# EAGLE design EnvironmentMonitorV3 (EAGLE 7.4.0)
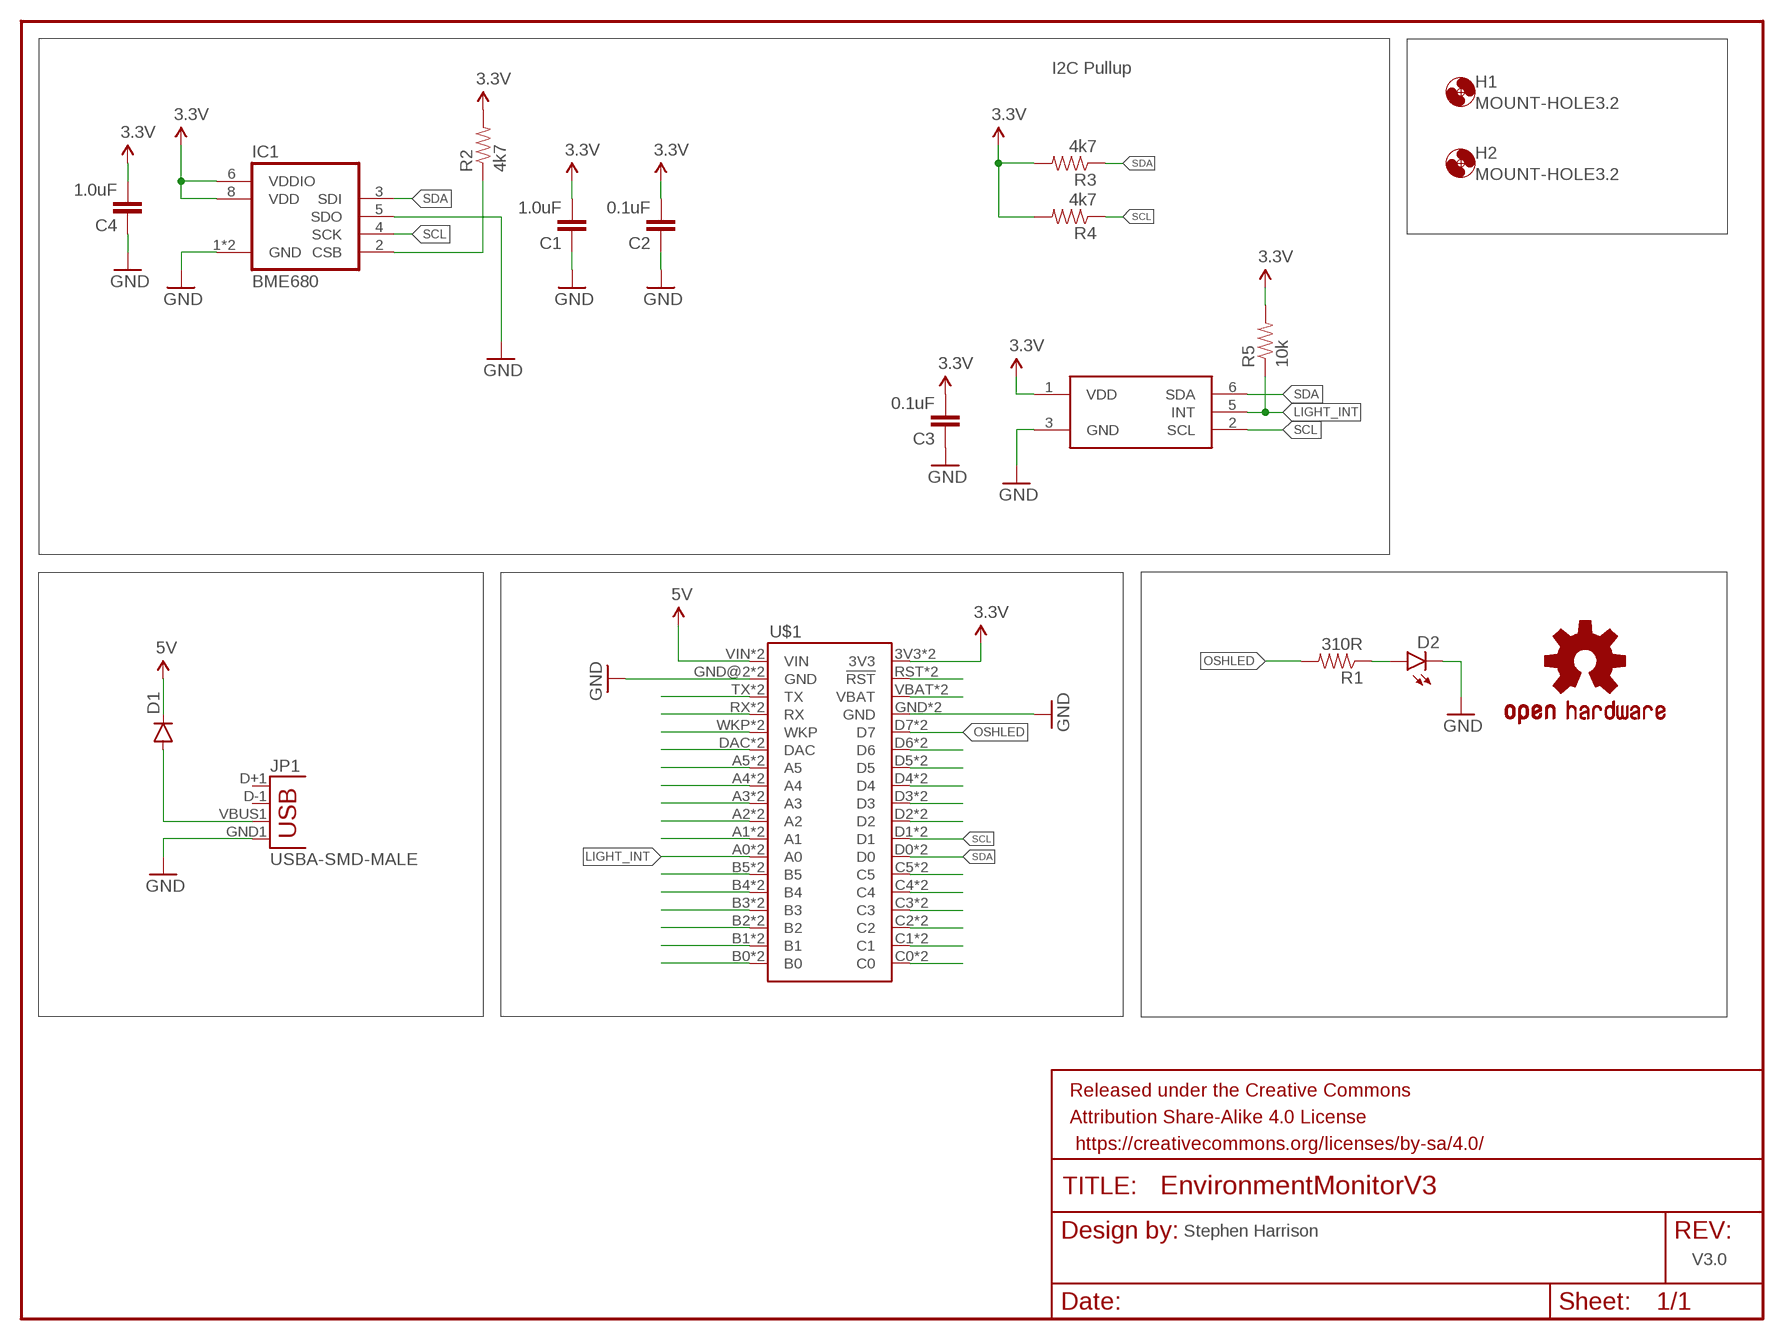
[diagram p0: schematic, sheet 1]

## Parts
C1  1.0uF  1.0UF-25V-+80/-20(0805)"  [0805-CAP]
C2  0.1uF  1.0UF-25V-+80/-20(0805)"  [0805-CAP]
C3  0.1uF  1.0UF-25V-+80/-20(0805)"  [0805-CAP]
C4  1.0uF  1.0UF-25V-+80/-20(0805)"  [0805-CAP]
D1  DIODESMA  [SMA-DIODE]
D2  LED1206-BOTTOM  [LED-1206-BOTTOM]
FRAME1  FRAME-LETTER  [CREATIVE_COMMONS]
H1  MOUNT-HOLE3.2  [3,2]
H2  MOUNT-HOLE3.2  [3,2]
IC1  BME680  [BME680]
JP1  USBA-SMD-MALE  [USB-A-SMT-MALE]
LOGO1  OSHW-LOGOM  [OSHW-LOGO-M]
R1  310R  RESISTOR0805-RES  [0805]
R2  4k7  RESISTOR0805-RES  [0805]
R3  4k7  RESISTOR0805-RES  [0805]
R4  4k7  RESISTOR0805-RES  [0805]
R5  10k  RESISTOR0805-RES  [0805]
U$1  ELECTRONDUALNAMED  [ELECTRON_SIMPLE_SILK_NAMES_DUAL]
U$2  TCS3472  [FN-6]

## Nets
3.3V: C1.2 C2.2 C3.2 C4.2 IC1.6(VDDIO) IC1.8(VDD) R2.2 R3.2 R4.2 R5.2 U$1.3V3 U$1.3V3_1(3V3) U$2.1(VDD)
5V: D1.C U$1.VIN U$1.VIN_1B(VIN)
GND: C1.1 C2.1 C3.1 C4.1 D2.C IC1.1(GND) IC1.5(SDO) IC1.7(GND) JP1.GND1(GND) U$1.GND U$1.GND@2(GND) U$1.GND_1(GND) U$1.GND_1B(GND) U$2.3(GND)
LIGHT_INT: R5.1 U$1.A0 U$1.A0_1(A0) U$2.5(INT)
N$1: U$1.RST(!RST) U$1.RST_1(!RST)
N$2: U$1.VBAT U$1.VBATT_1(VBAT)
N$3: IC1.2(CSB) R2.1
N$4: U$1.D6 U$1.D6_1(D6)
N$5: D1.A JP1.VBUS1(VBUS)
N$6: D2.A R1.1
N$7: U$1.D5 U$1.D5_1(D5)
N$8: U$1.D2 U$1.D2_1(D2)
N$9: U$1.D4 U$1.D4_1(D4)
N$10: U$1.D3 U$1.D3_1(D3)
N$11: U$1.C5 U$1.C5_1(C5)
N$12: U$1.C4 U$1.C4_1(C4)
N$13: U$1.C3 U$1.C3_1(C3)
N$14: U$1.C2 U$1.C2_1(C2)
N$15: U$1.C1 U$1.C1_1(C1)
N$16: U$1.C0 U$1.C0_1(C0)
N$17: U$1.B0 U$1.B0_1(B0)
N$18: U$1.B1 U$1.B1_1(B1)
N$19: U$1.B2 U$1.B2_1(B2)
N$20: U$1.B3 U$1.B3_1(B3)
N$21: U$1.B4 U$1.B4_1(B4)
N$22: U$1.B5 U$1.B5_1(B5)
N$23: U$1.A1 U$1.A1_1(A1)
N$25: U$1.A2 U$1.A2_1(A2)
N$26: U$1.A3 U$1.A3_1(A3)
N$27: U$1.A4 U$1.A4_1(A4)
N$28: U$1.A5 U$1.A5_1(A5)
N$29: U$1.DAC U$1.DAC_1(DAC)
N$30: U$1.WKP U$1.WKP_1(WKP)
N$31: U$1.RX U$1.RX_1(RX)
N$32: U$1.TX U$1.TX_1(TX)
OSHLED: R1.2 U$1.D7 U$1.D7_1(D7)
SCL: IC1.4(SCK) R4.1 U$1.D1 U$1.D1_1(D1) U$2.2(SCL)
SDA: IC1.3(SDI) R3.1 U$1.D0 U$1.D0_1(D0) U$2.6(SDA)
Unconnected: JP1.D+1(D+) JP1.D-1(D-)

## Notes on the sheet
- I2C Pullup
- Stephen Harrison
- V3.0

## Library data of the parts
C1 C4 = SparkFun-Capacitors:1.0UF-25V-+80/-20(0805): CAP-11625; PROD_ID: CAP-11625
C2 C3 = SparkFun-Capacitors:1.0UF-25V-+80/-20(0805): CAP-11625; PROD_ID: CAP-11625; VALUE: 1.0uF
D1 = SparkFun-DiscreteSemi:DIODE: Diode These are standard reverse protection diodes and small signal diodes. SMA package can handle up to about 1A. SOD-323 can handle about 200mA. What the SOD-323 package when ordering, there are some mfgs out there that are 5-pin packages.
D2 = SparkFun-LED:LED: LEDs Standard schematic elements and footprints for 5mm, 3mm, 1206, and 0603 sized LEDs. 5mm - Spark Fun Electronics SKU : COM-00529 (and others)
FRAME1 = SparkFun-Aesthetics:FRAME-LETTER: Schematic Frame Standard 8.5x11 US Letter frame
H1 H2 = holes:MOUNT-HOLE: MOUNTING HOLE with drill center marker
IC1 = bosch-bme680:BME680: BME680 integrates for the first time individual high linearity and high accuracy sensors for gas, pressure, humidity and temperature. The library has been designed by Richard Magdycz <https://www.facebook.com/groups/eaglecadsoftUK>
JP1 = Tinamous:USB: USB Connectors USB-B-PTH is fully proven SKU : PRT-00139/CONN-08278 USB-miniB is fully proven SKU : PRT-00587 USB-A-PCB is untested. USB-A-H is throughly reviewed, but untested. Spark Fun Electronics SKU : PRT-00437 USB-B-SMT is throughly reviewed, but untested. Needs silkscreen touching up. USB-A-S has not been used/tested USB-MB-H has not been used/tested USB-MICROB has been used. CONN-09505
LOGO1 = SparkFun-Aesthetics:OSHW-LOGO: Open Source Hardware Logo This logo indicates the piece of hardware it is found on incorporates a OSHW license and/or adheres to the definition of open source hardware found here: http://freedomdefined.org/OSHW
R1-R5 = SparkFun-Resistors:RESISTOR: Resistor Basic schematic elements and footprints for 0603, 1206, and PTH resistors.
U$1 = Tinamous:ELECTRON
U$2 = TCS3472:TCS3472

## Board
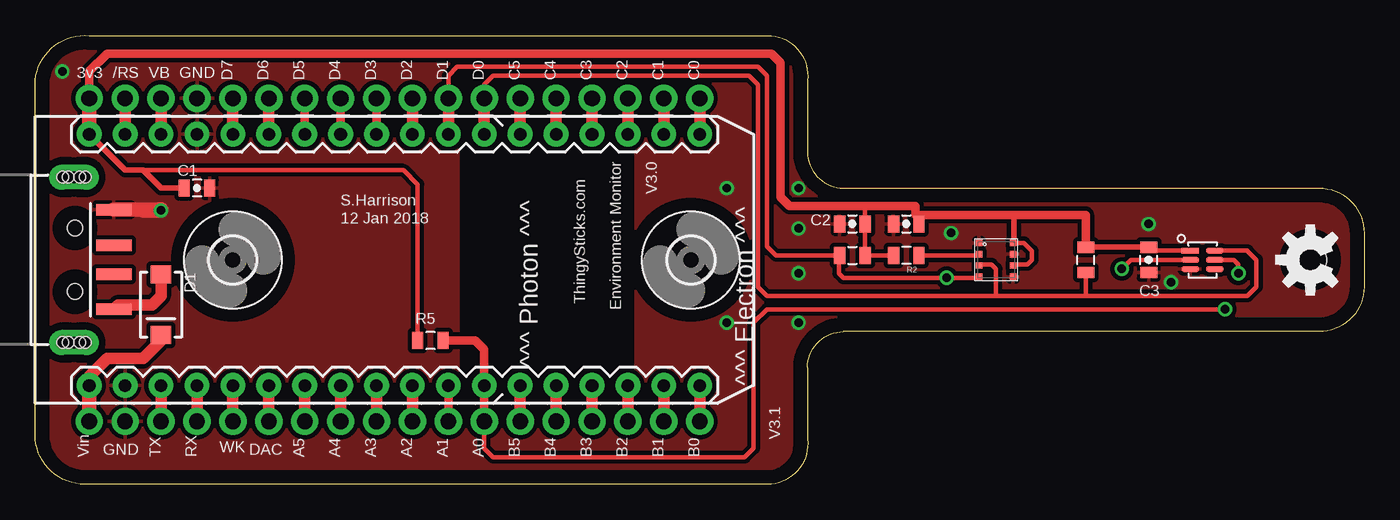
[diagram p1: board, top side]
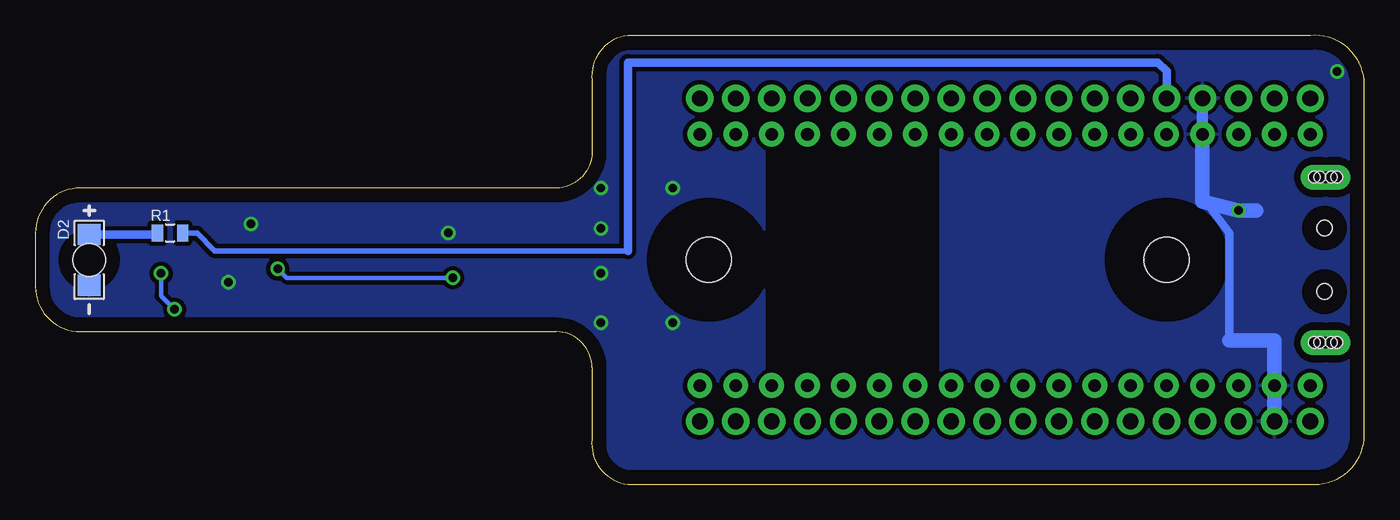
[diagram p2: board, bottom side, seen from below]

Size 93.98 x 31.78 mm. Coordinates in mm from the lower left corner, seen from the top.
Outline: 0,3.19 0,28.59 arc-90 3.81,31.76 52.07,31.76 arc-90 54.61,28.59 54.61,23.51 arc90 57.15,20.97 90.81,20.97 arc-90 93.98,17.79 93.98,13.98 arc-90 90.81,10.81 57.15,10.81 arc90 54.61,8.27 54.61,3.19 arc-90 52.07,0.01 3.81,0.01 arc-90 0,3.19
Copper layers (1*16): Top 0.035mm / dielectric 1.5mm / Bottom 0.035mm
Design rules "default": minimum track width 10mil, minimum drill 24mil, track to track 8mil, track to pad 8mil, pad to pad 8mil, via to via 8mil, smd to smd 8mil, copper to edge 40mil, drill to drill 8mil, minimum pad ring 10mil, minimum via ring 8mil, stop-mask expansion 4mil, vias tented up to drill 0mil, thermal gap 10mil
tRestrict: area 30.5,5.1 to 41.9,26.7
bRestrict: area 30.5,5.1 to 41.9,26.7

### Footprints (pad centres in the part's own frame; a part is rotated, then mirrored left to right if it is on the bottom)
0805-CAP = smd 0.8 x 1.2: 1 -0.9,0; 2 0.9,0
SMA-DIODE = smd 1.27 x 1.47: A -2.15,0; C 2.15,0
LED-1206-BOTTOM = smd 1.5 x 1.6: A -1.8,0; C 1.8,0 | hole 2.3: 0,0
3,2 = hole 3.2: 0,0
BME680 = smd 0.45 x 0.45: 1 -1.2,-1.2; 2 -0.4,-1.2; 3 0.4,-1.2; 4 1.2,-1.2; 5 1.2,1.2; 6 0.4,1.2; 7 -0.4,1.2; 8 -1.2,1.2
USB-A-SMT-MALE = smd 0.8 x 2.5: D+1 1.027,-5.87; D-1 -1.027,-5.87; GND1 3.551,-5.87; VBUS1 -3.5,-5.87 | drill 0.8 pad 1.778 long: P$1 5.85,-3.05; P$3 -5.85,-3.05 | hole 1.1: 2.25,-3.12; -2.25,-3.12 | hole 0.8: -5.85,-3.45; -5.85,-3.85; -5.85,-2.65; -5.85,-2.25; 5.85,-3.45; 5.85,-3.85; 5.85,-2.65; 5.85,-2.25
0805 = smd 0.8 x 1.2: 1 -0.9,0; 2 0.9,0
ELECTRON_SIMPLE_SILK_NAMES_DUAL = drill 0.889 pad 1.753: 3V3 1.27,22.86; A0 29.21,5.08; A1 26.67,5.08; A2 24.13,5.08; A3 21.59,5.08; A4 19.05,5.08; A5 16.51,5.08; B0 44.45,5.08; B1 41.91,5.08; B2 39.37,5.08; B3 36.83,5.08; B4 34.29,5.08; B5 31.75,5.08; C0 44.45,22.86; C1 41.91,22.86; C2 39.37,22.86; C3 36.83,22.86; C4 34.29,22.86; C5 31.75,22.86; D0 29.21,22.86; D1 26.67,22.86; D2 24.13,22.86; D3 21.59,22.86; D4 19.05,22.86; D5 16.51,22.86; D6 13.97,22.86; D7 11.43,22.86; DAC 13.97,5.08; GND 8.89,22.86; GND@2 3.81,5.08; RST 3.81,22.86; RX 8.89,5.08; TX 6.35,5.08; VBAT 6.35,22.86; VIN 1.27,5.08; WKP 11.43,5.08 | drill 1.1 pad 1.93: 3V3_1 1.27,25.4; A0_1 29.21,2.54; A1_1 26.67,2.54; A2_1 24.13,2.54; A3_1 21.59,2.54; A4_1 19.05,2.54; A5_1 16.51,2.54; B0_1 44.45,2.54; B1_1 41.91,2.54; B2_1 39.37,2.54; B3_1 36.83,2.54; B4_1 34.29,2.54; B5_1 31.75,2.54; C0_1 44.45,25.4; C1_1 41.91,25.4; C2_1 39.37,25.4; C3_1 36.83,25.4; C4_1 34.29,25.4; C5_1 31.75,25.4; D0_1 29.21,25.4; D1_1 26.67,25.4; D2_1 24.13,25.4; D3_1 21.59,25.4; D4_1 19.05,25.4; D5_1 16.51,25.4; D6_1 13.97,25.4; D7_1 11.43,25.4; DAC_1 13.97,2.54; GND_1 8.89,25.4; GND_1B 3.81,2.54; RST_1 3.81,25.4; RX_1 8.89,2.54; TX_1 6.35,2.54; VBATT_1 6.35,25.4; VIN_1B 1.27,2.54; WKP_1 11.43,2.54
FN-6 = smd 1.25 x 0.4: 1 -0.875,0.65; 2 -0.875,0; 3 -0.875,-0.65; 4 0.875,-0.65; 5 0.875,0; 6 0.875,0.65

### Placement (x,y rotation side)
C1  11.43,20.97 180 top
C2  57.78,18.43 0 top
C3  78.74,15.89 90 top
C4  61.59,18.43 0 top
D1  8.89,12.71 270 top
D2  90.17,15.89 270 bottom
FRAME1  1.27,-17.13 0 top  (outside the outline)
H1  13.97,15.89 0 top
H2  46.35,15.89 0 top
IC1  67.94,15.89 270 top
JP1  -0.32,15.89 90 top
LOGO1  90.17,15.89 90 top
R1  84.45,17.79 0 bottom
R2  61.59,16.21 180 top
R3  74.3,15.89 90 top
R4  57.78,16.21 0 top
R5  27.94,10.17 180 top
U$1  2.54,1.92 0 top
U$2  82.55,15.89 0 top

### Tracks (layer width: path | path; a pad name or v marks a point on that pad's centre or on a via)
3.3V
  Top 0.305: C4.2 62.23,18.43 62.23,19.06 | 58.42,19.7 58.69,19.43 C2.2 R4.2 R2.2 | IC1.8 69.92,17.09 70.48,16.52 70.48,15.89 70.17,15.57 69.23,15.57 IC1.6 | U$2.1 78.99,16.54 C3.2 | R5.2 27.04,21.23 26.04,22.24 7.62,22.24
  Top 0.406: U$1.3V3 6.35,22.24 7.62,22.24 8.89,20.97 C1.2 | IC1.8 69.22,17.09 69.22,19.06 | C3.2 R3.2
  Top 0.61: R3.2 74.3,19.06 69.22,19.06 62.23,19.06 62.23,19.7 58.42,19.7 53.34,19.7 52.7,20.33 52.7,29.86 52.07,30.49 5.08,30.49 3.81,29.22 U$1.3V3_1
  Top 1.016: U$1.3V3 U$1.3V3_1
5V
  Top 0.813: U$1.VIN 3.81,7.63 5.08,8.9 7.62,8.9 8.89,10.17 D1.C
  Top 1.016: U$1.VIN_1B U$1.VIN
GND  (via drill 0.6)
  Top 1.016: JP1.GND1 8.89,19.44 v8.89,19.38 7.62,19.38
  Bottom 0.61: U$1.GND 11.43,20.33 9.53,17.79 9.53,10.17
  Bottom 0.813: U$1.GND_1 U$1.GND
  Bottom 1.016: U$1.GND 11.43,20.02 v8.89,19.38 7.62,19.38 | 9.53,10.17 6.35,10.17 U$1.GND@2 U$1.GND_1B
  other vias: 53.98,18.11 53.98,14.94 53.98,20.97 1.91,29.22 53.98,11.44 78.74,18.43 48.9,11.44 48.9,20.97 80.33,14.3 64.77,17.79
  pour Bottom (isolate 0.305, rank 6): 94.61,32.4 94.61,-0.62 -0.64,-0.62 -0.64,32.4
  pour Top (isolate 0.305, rank 6): -0.64,32.4 94.61,31.76 94.61,-1.26 -0.64,-0.62
LIGHT_INT  (via drill 0.6)
  Top 0.305: U$2.5 84.77,15.89 85.09,15.57 v85.09,14.94 | v84.14,12.4 51.75,12.4 50.8,11.44 50.8,2.55 50.16,1.92 32.38,1.92 31.75,2.55 U$1.A0_1
  Top 0.61: U$1.A0_1 U$1.A0 31.75,9.54 31.11,10.17 R5.1
  Bottom 0.305: v85.09,14.94 85.09,13.35 v84.14,12.4
N$1
  Top 0.813: U$1.RST U$1.RST_1
N$2
  Top 0.813: U$1.VBATT_1 U$1.VBAT
N$3
  Top 0.305: IC1.2 66.66,16.21 R2.1
N$4
  Top 0.813: U$1.D6_1 U$1.D6
N$5
  Top 0.813: D1.A 8.89,13.35 8.26,12.71 5.88,12.71 JP1.VBUS1
N$6
  Bottom 0.61: D2.A 85.36,17.69 R1.1
N$7
  Top 0.61: U$1.D5_1 U$1.D5
N$8
  Top 0.813: U$1.D2_1 U$1.D2
N$9
  Top 0.61: U$1.D4 U$1.D4_1
N$10
  Top 0.61: U$1.D3_1 U$1.D3
N$11
  Top 0.813: U$1.C5 U$1.C5_1
N$12
  Top 0.813: U$1.C4_1 U$1.C4
N$13
  Top 0.813: U$1.C3 U$1.C3_1
N$14
  Top 0.813: U$1.C2_1 U$1.C2
N$15
  Top 0.813: U$1.C1 U$1.C1_1
N$16
  Top 0.813: U$1.C0_1 U$1.C0
N$17
  Top 0.813: U$1.B0 U$1.B0_1
N$18
  Top 0.813: U$1.B1_1 U$1.B1
N$19
  Top 0.813: U$1.B2 U$1.B2_1
N$20
  Top 0.813: U$1.B3_1 U$1.B3
N$21
  Top 0.813: U$1.B4 U$1.B4_1
N$22
  Top 0.813: U$1.B5_1 U$1.B5
N$23
  Top 0.61: U$1.A1 U$1.A1_1
N$25
  Top 0.813: U$1.A2 U$1.A2_1
N$26
  Top 0.813: U$1.A3_1 U$1.A3
N$27
  Top 0.813: U$1.A4 U$1.A4_1
N$28
  Top 0.813: U$1.A5 U$1.A5_1
N$29
  Top 0.813: U$1.DAC U$1.DAC_1
N$30
  Top 0.813: U$1.WKP U$1.WKP_1
N$31
  Top 0.813: U$1.RX U$1.RX_1
N$32
  Top 0.813: U$1.TX U$1.TX_1
OSHLED
  Top 0.813: U$1.D7_1 U$1.D7
  Bottom 0.406: R1.2 82.55,17.79 81.28,16.52 52.07,16.52
  Bottom 0.61: 52.07,16.52 52.07,29.86 14.61,29.86 13.97,29.22 U$1.D7_1
SCL  (via drill 0.6)
  Top 0.305: U$1.D1_1 29.21,28.91 29.84,29.54 51.12,29.54 51.75,28.91 51.75,16.84 52.39,16.21 R4.1 56.83,15.84 56.83,14.94 57.15,14.62 v64.45,14.62 66.67,14.62 IC1.4 | U$2.2 77.47,15.89 v76.83,15.25
  Top 0.813: U$1.D1 U$1.D1_1
  Bottom 0.305: v76.83,15.25 76.2,14.62 v64.45,14.62
SDA
  Top 0.305: 67.94,13.35 51.75,13.35 51.12,13.98 51.12,28.27 50.48,28.91 32.38,28.91 31.75,28.27 U$1.D0_1 | 67.94,13.35 67.94,15.25 67.63,15.57 66.83,15.57 IC1.3 | U$2.6 85.72,16.54 85.72,16.52 86.36,15.89 86.36,13.98 85.72,13.35 74.3,13.35 | 74.3,13.35 67.94,13.35 | R3.1 74.3,13.35
  Top 0.406: 74.3,14.89 R3.1
  Top 0.813: U$1.D0_1 U$1.D0

### Text on the board
tNames: Environment Monitor | V3.0 | ThingySticks.com | S.Harrison | 12 Jan 2018 | ^^^ Photon ^^^ | ^^^ Electron ^^^ | V3.1